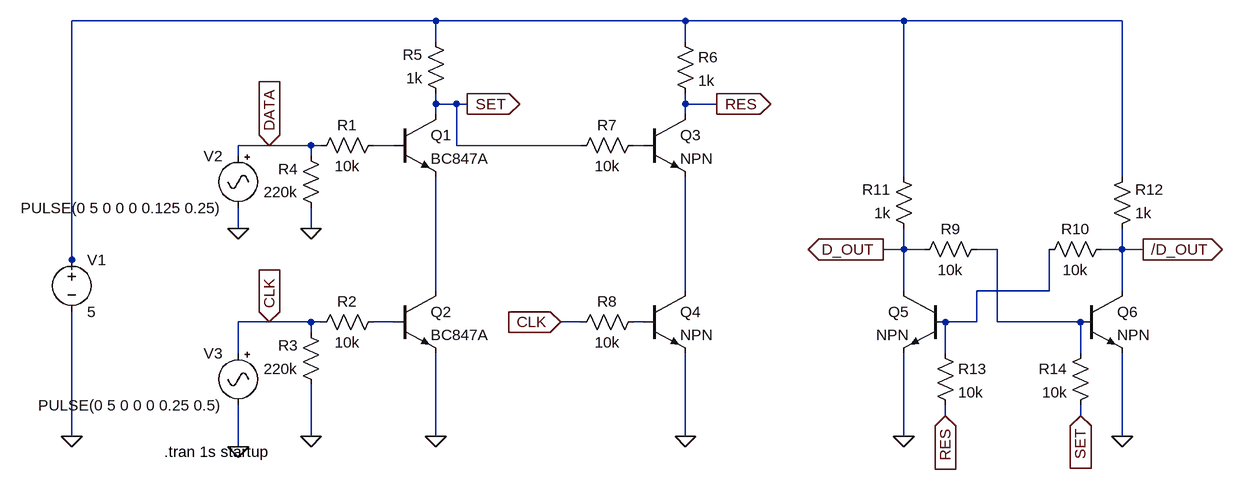
[diagram p0: schematic FlipFlop.asc]
FlipFlop.asc, the LTspice schematic file:
Version 4
SHEET 1 1440 680
WIRE 192 -176 -368 -176
WIRE 576 -176 192 -176
WIRE 912 -176 576 -176
WIRE 1248 -176 912 -176
WIRE 192 -144 192 -176
WIRE 576 -144 576 -176
WIRE 192 -48 192 -64
WIRE 224 -48 192 -48
WIRE 240 -48 224 -48
WIRE 576 -48 576 -64
WIRE 624 -48 576 -48
WIRE 192 -32 192 -48
WIRE 576 -32 576 -48
WIRE -64 16 -112 16
WIRE 0 16 -64 16
WIRE 16 16 0 16
WIRE 128 16 96 16
WIRE 224 16 224 -48
WIRE 416 16 224 16
WIRE 512 16 496 16
WIRE -112 32 -112 16
WIRE 0 32 0 16
WIRE 912 64 912 -176
WIRE 1248 64 1248 -176
WIRE -112 144 -112 112
WIRE 0 144 0 112
WIRE 912 176 912 144
WIRE 912 176 880 176
WIRE 944 176 912 176
WIRE 1056 176 1024 176
WIRE 1248 176 1248 144
WIRE 1248 176 1216 176
WIRE 1280 176 1248 176
WIRE -368 192 -368 -176
WIRE -368 208 -368 192
WIRE 192 240 192 64
WIRE 576 240 576 64
WIRE 912 240 912 176
WIRE 1136 240 1136 176
WIRE 1136 240 1024 240
WIRE 1248 240 1248 176
WIRE -64 288 -112 288
WIRE 0 288 -64 288
WIRE 16 288 0 288
WIRE 128 288 96 288
WIRE 416 288 384 288
WIRE 512 288 496 288
WIRE 1024 288 1024 240
WIRE 1024 288 976 288
WIRE 1056 288 1056 176
WIRE 1184 288 1056 288
WIRE 0 304 0 288
WIRE -112 336 -112 288
WIRE 976 336 976 288
WIRE 1184 336 1184 288
WIRE 976 432 976 416
WIRE 1184 432 1184 416
WIRE -368 464 -368 272
WIRE 0 464 0 384
WIRE 192 464 192 336
WIRE 576 464 576 336
WIRE 912 464 912 336
WIRE 1248 464 1248 336
WIRE -112 480 -112 416
FLAG 192 464 0
FLAG 0 144 0
FLAG 0 464 0
FLAG -368 464 0
FLAG 240 -48 SET
IOPIN 240 -48 Out
FLAG -64 16 DATA
IOPIN -64 16 In
FLAG -64 288 CLK
IOPIN -64 288 In
FLAG -112 144 0
FLAG -112 480 0
FLAG 576 464 0
FLAG 384 288 CLK
IOPIN 384 288 In
FLAG 624 -48 RES
IOPIN 624 -48 Out
FLAG 912 464 0
FLAG 1248 464 0
FLAG 976 432 RES
IOPIN 976 432 In
FLAG 1184 432 SET
IOPIN 1184 432 In
FLAG 880 176 D_OUT
IOPIN 880 176 Out
FLAG 1280 176 /D_OUT
IOPIN 1280 176 Out
SYMBOL npn 128 -32 R0
SYMATTR InstName Q1
SYMATTR Value BC847A
SYMBOL npn 128 240 R0
SYMATTR InstName Q2
SYMATTR Value BC847A
SYMBOL voltage -368 176 R0
WINDOW 123 0 0 Left 2
WINDOW 39 0 0 Left 2
SYMATTR InstName V1
SYMATTR Value 5
SYMBOL res 112 0 R90
WINDOW 0 0 56 VBottom 2
WINDOW 3 32 56 VTop 2
SYMATTR InstName R1
SYMATTR Value 10k
SYMBOL res 112 272 R90
WINDOW 0 0 56 VBottom 2
WINDOW 3 32 56 VTop 2
SYMATTR InstName R2
SYMATTR Value 10k
SYMBOL res 16 400 R180
WINDOW 0 36 76 Left 2
WINDOW 3 36 40 Left 2
SYMATTR InstName R3
SYMATTR Value 220k
SYMBOL res 16 128 R180
WINDOW 0 36 76 Left 2
WINDOW 3 36 40 Left 2
SYMATTR InstName R4
SYMATTR Value 220k
SYMBOL res 208 -48 R180
WINDOW 0 36 76 Left 2
WINDOW 3 36 40 Left 2
SYMATTR InstName R5
SYMATTR Value 1k
SYMBOL Misc\\signal -112 16 M0
WINDOW 123 0 0 Left 2
WINDOW 39 0 0 Left 2
SYMATTR InstName V2
SYMATTR Value PULSE(0 5 0 0 0 0.125 0.25)
SYMBOL Misc\\signal -112 320 M0
WINDOW 123 0 0 Left 2
WINDOW 39 0 0 Left 2
SYMATTR InstName V3
SYMATTR Value PULSE(0 5 0 0 0 0.25 0.5)
SYMBOL npn 512 -32 R0
SYMATTR InstName Q3
SYMBOL npn 512 240 R0
SYMATTR InstName Q4
SYMBOL res 560 -160 R0
SYMATTR InstName R6
SYMATTR Value 1k
SYMBOL res 512 0 R90
WINDOW 0 0 56 VBottom 2
WINDOW 3 32 56 VTop 2
SYMATTR InstName R7
SYMATTR Value 10k
SYMBOL res 512 272 R90
WINDOW 0 0 56 VBottom 2
WINDOW 3 32 56 VTop 2
SYMATTR InstName R8
SYMATTR Value 10k
SYMBOL npn 976 240 M0
SYMATTR InstName Q5
SYMBOL npn 1184 240 R0
SYMATTR InstName Q6
SYMBOL res 1040 160 R90
WINDOW 0 0 56 VBottom 2
WINDOW 3 32 56 VTop 2
SYMATTR InstName R9
SYMATTR Value 10k
SYMBOL res 1232 160 R90
WINDOW 0 0 56 VBottom 2
WINDOW 3 32 56 VTop 2
SYMATTR InstName R10
SYMATTR Value 10k
SYMBOL res 928 160 R180
WINDOW 0 36 76 Left 2
WINDOW 3 36 40 Left 2
SYMATTR InstName R11
SYMATTR Value 1k
SYMBOL res 1232 160 M180
WINDOW 0 36 76 Left 2
WINDOW 3 36 40 Left 2
SYMATTR InstName R12
SYMATTR Value 1k
SYMBOL res 960 320 R0
SYMATTR InstName R13
SYMATTR Value 10k
SYMBOL res 1200 320 M0
SYMATTR InstName R14
SYMATTR Value 10k
TEXT -226 488 Left 2 !.tran 1s startup

The netlist it stands for:
* FlipFlop.asc
Q1 SET N002 N005 0 BC847A
Q2 N005 N008 0 0 BC847A
V1 N001 0 5
R1 N002 DATA 10k
R2 N008 CLK 10k
R3 0 CLK 220k
R4 0 DATA 220k
R5 SET N001 1k
V2 DATA 0 PULSE(0 5 0 0 0 0.125 0.25)
V3 CLK 0 PULSE(0 5 0 0 0 0.25 0.5)
Q3 RES N003 N006 0 NPN
Q4 N006 N009 0 0 NPN
R6 N001 RES 1k
R7 N003 SET 10k
R8 N009 CLK 10k
Q5 D_OUT N007 0 0 NPN
Q6 /D_OUT N004 0 0 NPN
R9 N004 D_OUT 10k
R10 /D_OUT N007 10k
R11 D_OUT N001 1k
R12 /D_OUT N001 1k
R13 N007 RES 10k
R14 N004 SET 10k
.model NPN NPN
.model PNP PNP
.lib standard.bjt
.tran 1s startup
.backanno
.end